# EAGLE design rpi-shield (EAGLE 9.6.2)
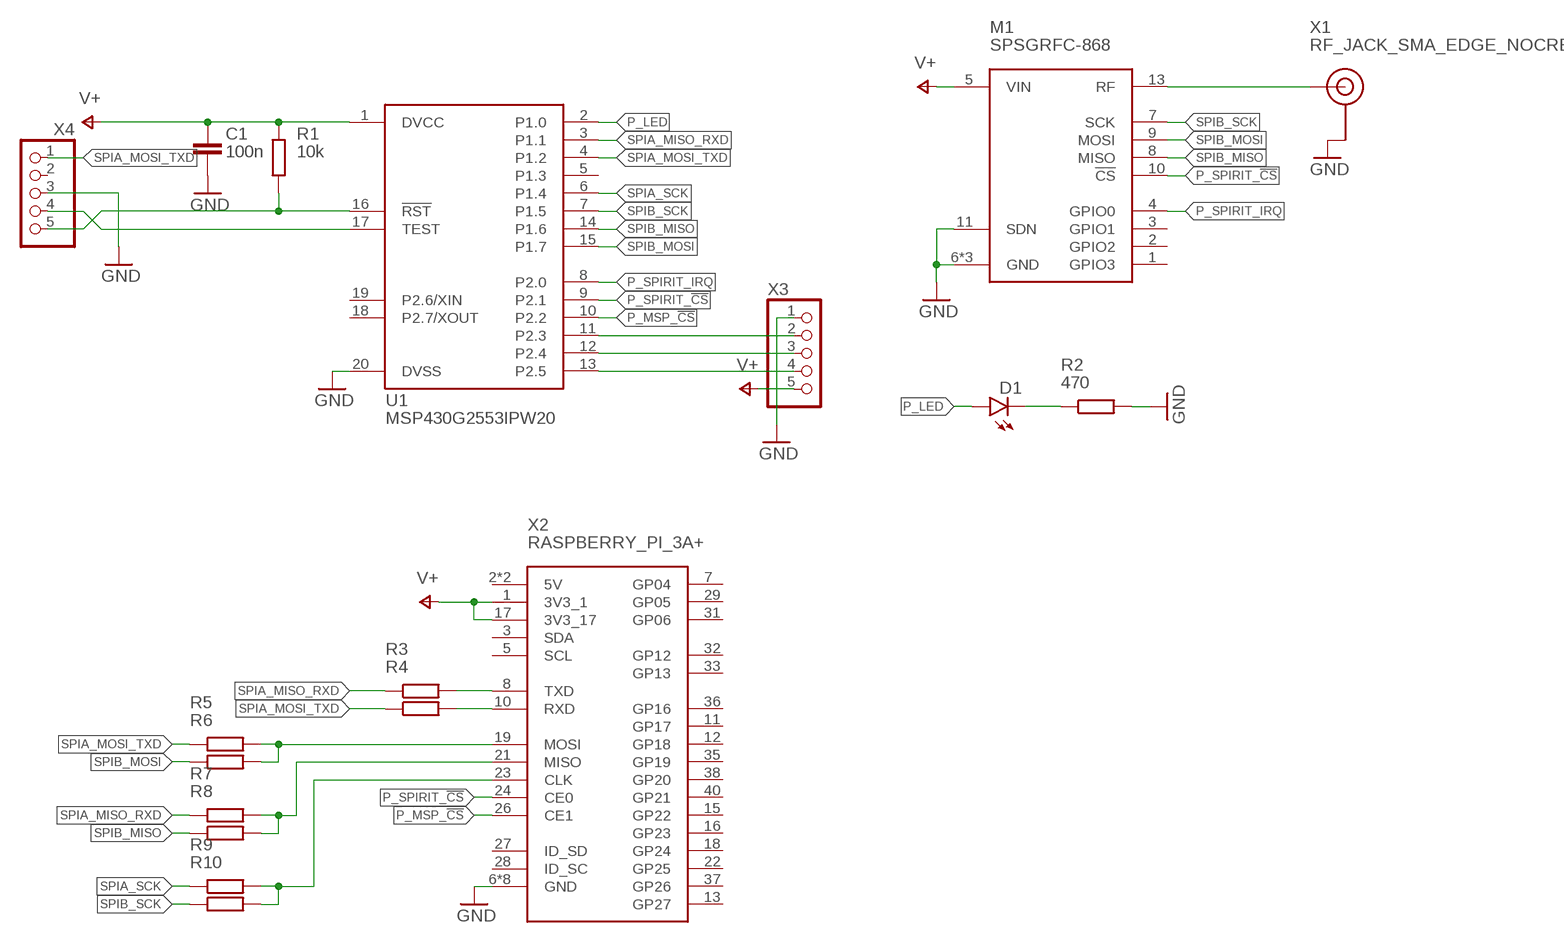
[diagram p0: schematic, sheet 1]

## Parts
C1  100n  C0603  [C0603]
D1  LEDCHIPLED_0805  [CHIPLED_0805]
M1  SPSGRFC-868  [SPSGRFC-868]
R1  10k  R0603  [R0603]
R2  470  R0603  [R0603]
R3  R0603_STOP  [R0603_STOP]
R4  R0603_STOP  [R0603_STOP]
R5  R0603_STOP  [R0603_STOP]
R6  R0603_STOP  [R0603_STOP]
R7  R0603_STOP  [R0603_STOP]
R8  R0603_STOP  [R0603_STOP]
R9  R0603_STOP  [R0603_STOP]
R10  R0603_STOP  [R0603_STOP]
U1  MSP430G2553IPW20  [PW20]
X1  RF_JACK_SMA_EDGE_NOCREAM  [RF_SMA_JACK_EDGE_NOCREAM]
X2  RASPBERRY_PI_3A+  [RASPBERRY_PI_3A+]
X3  PINHD_5_RND  [1X05]
X4  PINHD_5_RND  [1X05]

## Nets
GND: C1.2 M1.6(GND) M1.11(SDN) M1.12(GND) M1.14(GND) R2.2 U1.20(DVSS) X1.2(GND) X1.3(GND) X1.4(GND) X1.5(GND) X2.6(GND) X2.9(GND) X2.14(GND) X2.20(GND) X2.25(GND) X2.30(GND) X2.34(GND) X2.39(GND) X3.1 X4.3
N$1: D1.C R2.1
N$2: R1.1 U1.16(!RST!) X4.5
N$3: U1.17(TEST) X4.4
N$4: M1.13(RF) X1.1(SIGNAL)
N$5: R3.2 X2.8(TXD)
N$6: R4.2 X2.10(RXD)
N$7: R5.2 R6.2 X2.19(MOSI)
N$8: R7.2 R8.2 X2.21(MISO)
N$9: R9.2 R10.2 X2.23(CLK)
N$10: U1.13(P2.5) X3.4
N$11: U1.12(P2.4) X3.3
N$12: U1.11(P2.3) X3.2
P_LED: D1.A U1.2(P1.0)
P_MSP_!CS: U1.10(P2.2) X2.26(CE1)
P_SPIRIT_!CS: M1.10(!CS) U1.9(P2.1) X2.24(CE0)
P_SPIRIT_IRQ: M1.4(GPIO0) U1.8(P2.0)
SPIA_MISO_RXD: R3.1 R7.1 U1.3(P1.1)
SPIA_MOSI_TXD: R4.1 R5.1 U1.4(P1.2) X4.1
SPIA_SCK: R9.1 U1.6(P1.4)
SPIB_MISO: M1.8(MISO) R8.1 U1.14(P1.6)
SPIB_MOSI: M1.9(MOSI) R6.1 U1.15(P1.7)
SPIB_SCK: M1.7(SCK) R10.1 U1.7(P1.5)
V+: C1.1 M1.5(VIN) R1.2 U1.1(DVCC) X2.1(3V3_1) X2.17(3V3_17) X3.5
Unconnected: M1.1(GPIO3) M1.2(GPIO2) M1.3(GPIO1) U1.5(P1.3) U1.18(P2.7/XOUT) U1.19(P2.6/XIN) X2.2(5V) X2.3(SDA) X2.4(5V) X2.5(SCL) X2.7(GP04) X2.11(GP17) X2.12(GP18) X2.13(GP27) X2.15(GP22) X2.16(GP23) X2.18(GP24) X2.22(GP25) X2.27(ID_SD) X2.28(ID_SC) X2.29(GP05) X2.31(GP06) X2.32(GP12) X2.33(GP13) X2.35(GP19) X2.36(GP16) X2.37(GP26) X2.38(GP20) X2.40(GP21) X4.2

## Library data of the parts
C1 = rfr-lib-passive:C: Standard-SMD-Kondensatoren
D1 = led:LED: LED OSRAM: - CHIPLED LG R971, LG N971, LY N971, LG Q971, LY Q971, LO R971, LY R971 LH N974, LH R974 LS Q976, LO Q976, LY Q976 LO Q996 - Hyper CHIPLED LW Q18S LB Q993, LB Q99A, LB R99A - SideLED LS A670, LO A670, LY A670, LG A670, LP A670 LB A673, LV A673, LT A673, LW A673 LH A674 LY A675 LS A676, LA A676, LO A676, LY A676, LW A676 LS A679, LY A679, LG A679 - Hyper Micro SIDELED® LS Y876, LA Y876, LO Y876, LY Y876 LT Y87S - SmartLED LW L88C, LW L88S LB L89C, LB L89S, LG L890 LS L89K, LO L89K, LY L89K LS L896, LA L896, LO L896, LY L896 - TOPLED LS T670, LO T670, LY T670, LG T670, LP T670 LSG T670, LSP T670, LSY T670, LOP T670, LYG T670 LG T671, LOG T671, LSG T671 LB T673, LV T673, LT T673, LW T673 LH T674 LS T676, LA T676, LO T676, LY T676, LB T676, LH T676, LSB T676, LW T676 LB T67C, LV T67C, LT T67C, LS T67K, LO T67K, LY T67K, LW E67C LS E67B, LA E67B, LO E67B, LY E67B, LB E67C, LV E67C, LT E67C LW T67C LS T679, LY T679, LG T679 LS T770, LO T770, LY T770, LG T770, LP T770 LB T773, LV T773, LT T773, LW T773 LH T774 LS E675, LA E675, LY E675, LS T675 LS T776, LA T776, LO T776, LY T776, LB T776 LHGB T686 LT T68C, LB T68C - Hyper Mini TOPLED® LB M676 - Mini TOPLED Santana® LG M470 LS M47K, LO M47K, LY M47K Source: http://www.osram.convergy.de LUXEON: - LUMILED® LXK2-PW12-R00, LXK2-PW12-S00, LXK2-PW14-U00, LXK2-PW14-V00 LXK2-PM12-R00, LXK2-PM12-S00, LXK2-PM14-U00 LXK2-PE12-Q00, LXK2-PE12-R00, LXK2-PE12-S00, LXK2-PE14-T00, LXK2-PE14-U00 LXK2-PB12-K00, LXK2-PB12-L00, LXK2-PB12-M00, LXK2-PB14-N00, LXK2-PB14-P00, LXK2-PB14-Q00 LXK2-PR12-L00, LXK2-PR12-M00, LXK2-PR14-Q00, LXK2-PR14-R00 LXK2-PD12-Q00, LXK2-PD12-R00, LXK2-PD12-S00 LXK2-PH12-R00, LXK2-PH12-S00 LXK2-PL12-P00, LXK2-PL12-Q00, LXK2-PL12-R00 Source: www.luxeon.com KINGBRIGHT: KA-3528ASYC Source: www.kingbright.com
M1 = rfr-lib-radio:SPSGRFC-868
R1-R10 = rfr-lib-passive:R: Standard-SMD-Widerstände
U1 = rfr-lib-digital:MSP430G2553: MSP430G2XX1 TSSOP (PW) 20 Pin Package
X1 = rfr-lib-connector:RF_JACK: Standard SMA-Adapter mit vertikaler Befestigung
X2 = rfr-lib-misc:RASPBERRY_PI_3A+
X3 X4 = rfr-lib-connector:PINHD_5_RND

## Board
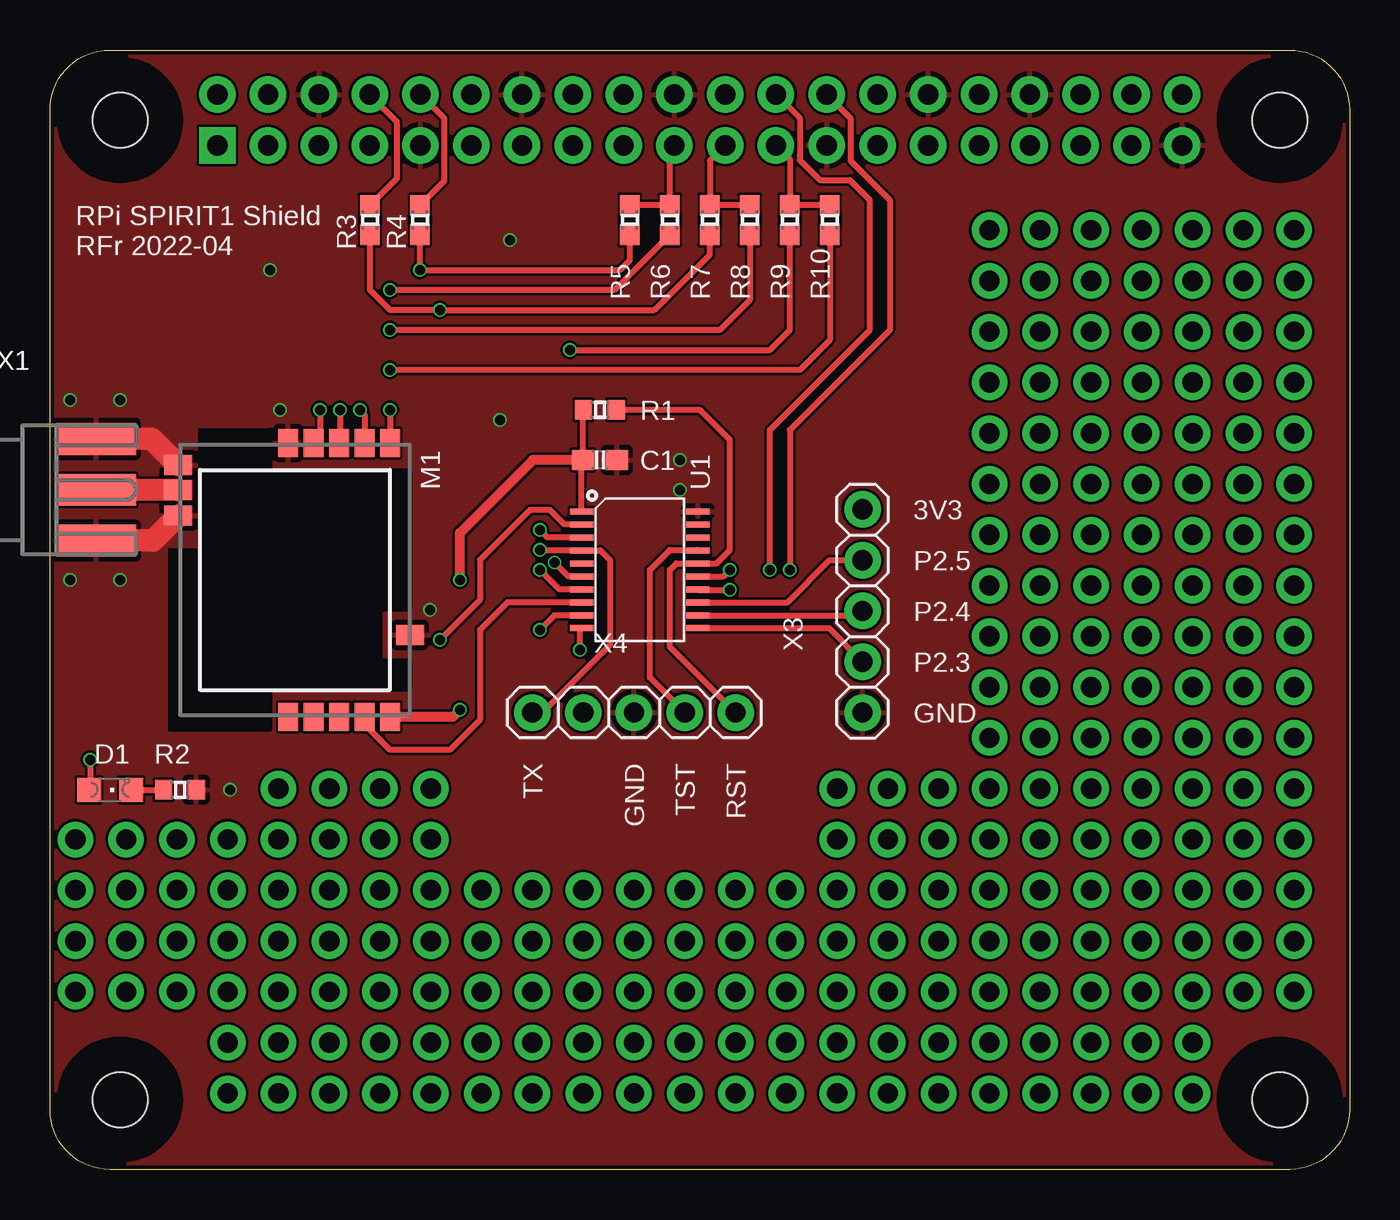
[diagram p1: board, top side]
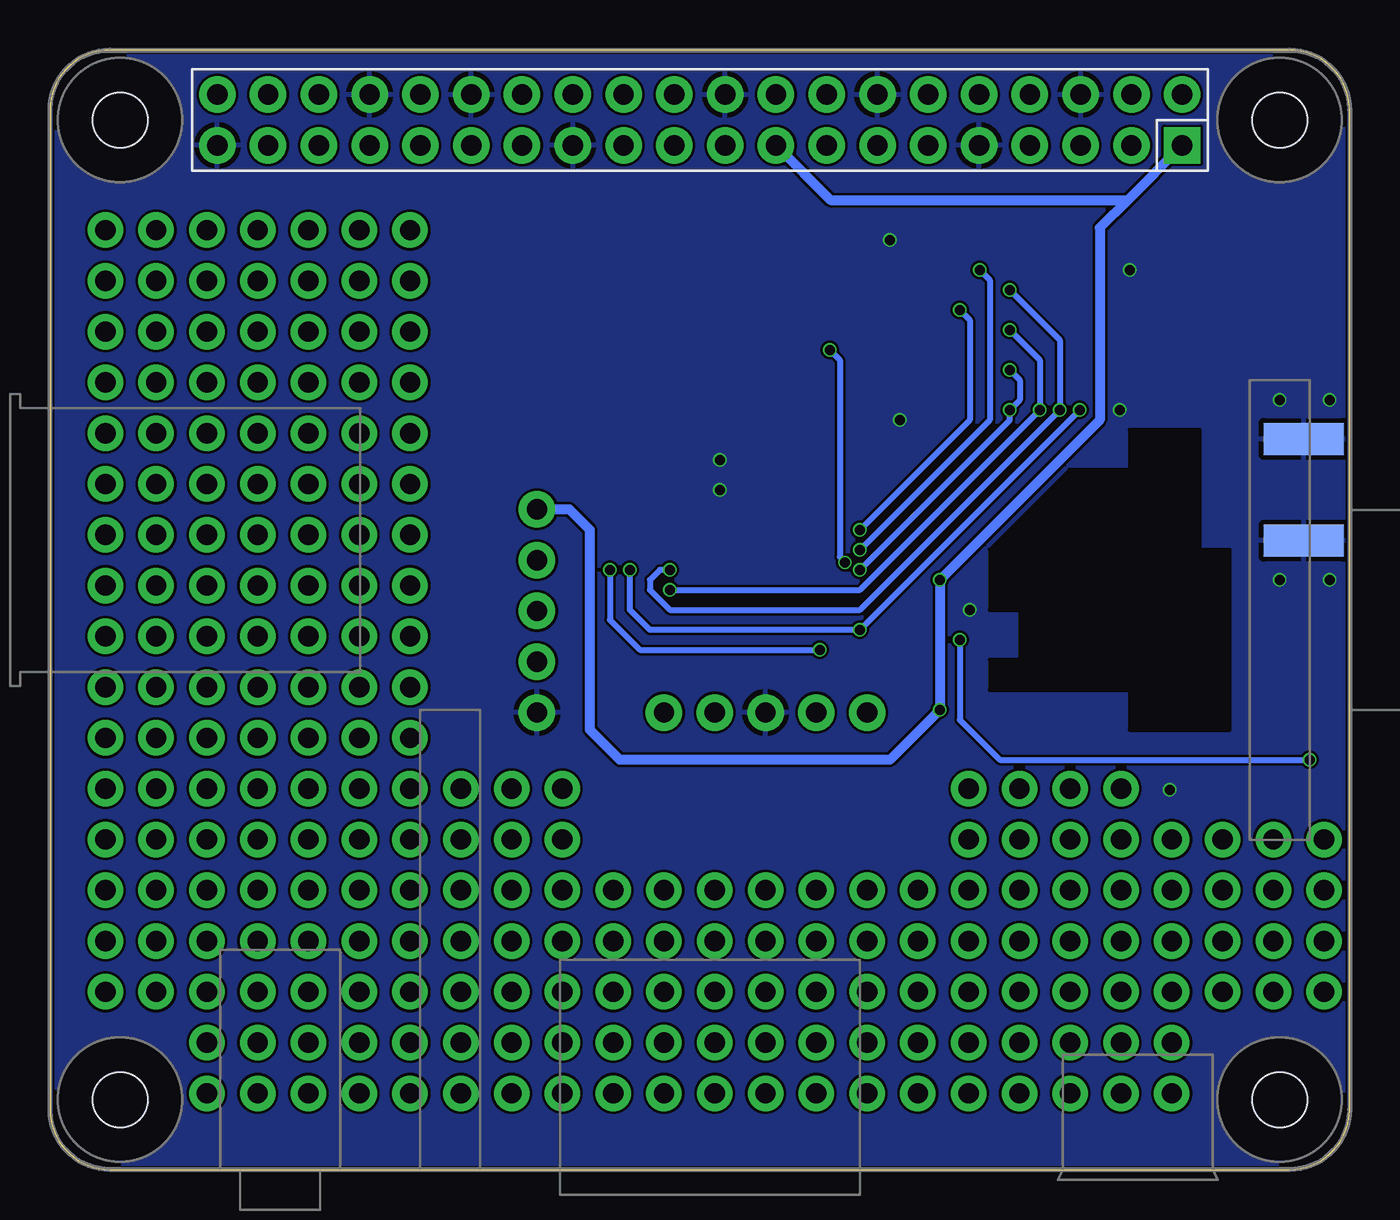
[diagram p2: board, bottom side, seen from below]

Size 65 x 56 mm. Coordinates in mm from the lower left corner, seen from the top.
Outline: 65,53 65,3 arc-90 62,0 3,0 arc-90 0,3 0,53 arc-90 3,56 62,56 arc-90 65,53
Copper layers (1*16): Top 0.035mm / dielectric 1.6mm / Bottom 0.035mm
Design rules "jlcpcb-2layers *": minimum track width 5mil, minimum drill 0.3mm, track to track 5mil, track to pad 5mil, pad to pad 5mil, via to via 5mil, smd to smd 5mil, copper to edge 0.2mm, drill to drill 6mil, minimum pad ring 10mil, minimum via ring 3mil, stop-mask expansion 4mil, vias tented up to drill 0.7mm, thermal gap 10mil
tRestrict: area 6,22 to 18,37
bRestrict: area 6,22 to 18,37

### Footprints (pad centres in the part's own frame; a part is rotated, then mirrored left to right if it is on the bottom)
C0603 = smd 1.1 x 1: 1 -0.85,0; 2 0.85,0
CHIPLED_0805 = smd 1.2 x 1.2: A 0,-1.05; C 0,1.05
SPSGRFC-868 = smd 1.4 x 1: 1 -6.85,6.08; 2 -6.85,4.81; 3 -6.85,3.54; 4 -6.85,2.27; 5 -6.85,1; 7 6.85,1; 8 6.85,2.27; 9 6.85,3.54; 10 6.85,4.81; 11 6.85,6.08 | smd 1 x 1.4: 6 -2.75,0; 12 5.75,11.6; 13 4.48,11.6; 14 3.21,11.6
R0603 = smd 0.87 x 0.98: 1 -0.815,0; 2 0.815,0
R0603_STOP = smd 1.05 x 0.98: 1 -0.725,0; 2 0.725,0
PW20 = smd 0.3 x 1.2: 1 -2.925,-2.9; 2 -2.275,-2.9; 3 -1.625,-2.9; 4 -0.975,-2.9; 5 -0.325,-2.9; 6 0.325,-2.9; 7 0.975,-2.9; 8 1.625,-2.9; 9 2.275,-2.9; 10 2.925,-2.9; 11 2.925,2.9; 12 2.275,2.9; 13 1.625,2.9; 14 0.975,2.9; 15 0.325,2.9; 16 -0.325,2.9; 17 -0.975,2.9; 18 -1.625,2.9; 19 -2.275,2.9; 20 -2.925,2.9
RF_SMA_JACK_EDGE_NOCREAM = smd 4 x 1.6: 1 2,0; 4 2,2.54; 5 2,-2.54 | smd 4 x 1.6 bottom: 2 2,2.54; 3 2,-2.54
RASPBERRY_PI_3A+ = drill 1.016 pad 1.778 square: 1 8.37,51.23 | drill 1.016 pad 1.778: 2 8.37,53.77; 3 10.91,51.23; 4 10.91,53.77; 5 13.45,51.23; 6 13.45,53.77; 7 15.99,51.23; 8 15.99,53.77; 9 18.53,51.23; 10 18.53,53.77; 11 21.07,51.23; 12 21.07,53.77; 13 23.61,51.23; 14 23.61,53.77; 15 26.15,51.23; 16 26.15,53.77; 17 28.69,51.23; 18 28.69,53.77; 19 31.23,51.23; 20 31.23,53.77; 21 33.77,51.23; 22 33.77,53.77; 23 36.31,51.23; 24 36.31,53.77; 25 38.85,51.23; 26 38.85,53.77; 27 41.39,51.23; 28 41.39,53.77; 29 43.93,51.23; 30 43.93,53.77; 31 46.47,51.23; 32 46.47,53.77; 33 49.01,51.23; 34 49.01,53.77; 35 51.55,51.23; 36 51.55,53.77; 37 54.09,51.23; 38 54.09,53.77; 39 56.63,51.23; 40 56.63,53.77 | hole 2.75: 3.5,3.5; 3.5,52.5; 61.5,3.5; 61.5,52.5
1X05 = drill 1.016 pad 1.778: 1 -5.08,0; 2 -2.54,0; 3 0,0; 4 2.54,0; 5 5.08,0

### Placement (x,y rotation side)
C1  27.5,35.5 0 top
D1  3,19 270 top
M1  18,29.5 90 top
R1  27.5,38 180 top
R2  6.5,19 0 top
R3  16,47.5 90 top
R4  18.5,47.5 90 top
R5  29,47.5 90 top
R6  31,47.5 90 top
R7  33,47.5 90 top
R8  35,47.5 90 top
R9  37,47.5 90 top
R10  39,47.5 90 top
U1  29.5,30 270 top
X1  0.3,34 0 top
X2  0,0 0 top
X3  40.64,27.94 90 top
X4  29.21,22.86 0 top

### Tracks (layer width: path | path; a pad name or v marks a point on that pad's centre or on a via)
GND  (via drill 0.5)
  Top 1.1: M1.12 5.11,36.54 X1.4 | M1.14 5.15,31.46 X1.5
  other vias: 1,38.5 3.5,38.5 1,29.5 3.5,29.5 11.5,38 19,28 9,19 31.5,34 31.5,35.5 23,46.5 22.5,37.5 11,45
  pour Top: -1,57 66,57 66,16.5 66,-1 38.5,-1 -1,-1
  pour Bottom: 65.5,56.5 -1.5,56.5 -1.5,16 -1.5,-1.5 26,-1.5 65.5,-1.5
N$1
  Top 0.3: D1.C R2.1
N$2
  Top 0.3: X4.5 31,26.15 31,30 31.32,30.32 U1.16 33.33,30.32 34,31 34,36.5 32.5,38 R1.1
N$3
  Top 0.3: X4.4 30,24.61 30,30 31,31 32.38,31 U1.17
N$4
  Top 1.1: M1.13 3.52,33.98 3.5,34 X1.1
N$5
  Top 0.3: X2.8 17.34,52.42 17.34,49.56 R3.2
N$6
  Top 0.3: X2.10 19.72,52.58 19.72,49.45 R4.2
N$7
  Top 0.3: R5.2 R6.2 31,51 X2.19
N$8
  Top 0.3: R8.2 R7.2 33,50.46 X2.21
N$9
  Top 0.3: X2.23 37,50.54 R9.2 R10.2
N$10
  Top 0.3: U1.13 36.88,28.38 38.98,30.48 X3.4
N$11
  Top 0.3: U1.12 40.42,27.73 X3.3
N$12
  Top 0.3: U1.11 38.97,27.07 X3.2
N$13  (via drill 1.02 pad 1.78)
  other vias: 1.27,16.51
N$14  (via drill 1.02 pad 1.78)
  other vias: 1.27,13.97
N$15  (via drill 1.02 pad 1.78)
  other vias: 1.27,11.43
N$16  (via drill 1.02 pad 1.78)
  other vias: 3.81,16.51
N$17  (via drill 1.02 pad 1.78)
  other vias: 3.81,13.97
N$18  (via drill 1.02 pad 1.78)
  other vias: 3.81,11.43
N$19  (via drill 1.02 pad 1.78)
  other vias: 6.35,16.51
N$20  (via drill 1.02 pad 1.78)
  other vias: 6.35,13.97
N$21  (via drill 1.02 pad 1.78)
  other vias: 6.35,11.43
N$22  (via drill 1.02 pad 1.78)
  other vias: 1.27,8.89
N$23  (via drill 1.02 pad 1.78)
  other vias: 3.81,8.89
N$24  (via drill 1.02 pad 1.78)
  other vias: 6.35,8.89
N$25  (via drill 1.02 pad 1.78)
  other vias: 8.89,16.51
N$26  (via drill 1.02 pad 1.78)
  other vias: 8.89,13.97
N$27  (via drill 1.02 pad 1.78)
  other vias: 8.89,11.43
N$28  (via drill 1.02 pad 1.78)
  other vias: 8.89,8.89
N$29  (via drill 1.02 pad 1.78)
  other vias: 8.89,6.35
N$30  (via drill 1.02 pad 1.78)
  other vias: 8.89,3.81
N$31  (via drill 1.02 pad 1.78)
  other vias: 11.43,3.81
N$32  (via drill 1.02 pad 1.78)
  other vias: 11.43,6.35
N$33  (via drill 1.02 pad 1.78)
  other vias: 11.43,8.89
N$34  (via drill 1.02 pad 1.78)
  other vias: 11.43,11.43
N$35  (via drill 1.02 pad 1.78)
  other vias: 11.43,13.97
N$36  (via drill 1.02 pad 1.78)
  other vias: 11.43,16.51
N$37  (via drill 1.02 pad 1.78)
  other vias: 11.43,19.05
N$38  (via drill 1.02 pad 1.78)
  other vias: 13.97,19.05
N$39  (via drill 1.02 pad 1.78)
  other vias: 13.97,16.51
N$40  (via drill 1.02 pad 1.78)
  other vias: 13.97,13.97
N$41  (via drill 1.02 pad 1.78)
  other vias: 13.97,11.43
N$42  (via drill 1.02 pad 1.78)
  other vias: 13.97,8.89
N$43  (via drill 1.02 pad 1.78)
  other vias: 13.97,6.35
N$44  (via drill 1.02 pad 1.78)
  other vias: 13.97,3.81
N$45  (via drill 1.02 pad 1.78)
  other vias: 16.51,3.81
N$46  (via drill 1.02 pad 1.78)
  other vias: 16.51,6.35
N$47  (via drill 1.02 pad 1.78)
  other vias: 16.51,8.89
N$48  (via drill 1.02 pad 1.78)
  other vias: 16.51,11.43
N$49  (via drill 1.02 pad 1.78)
  other vias: 16.51,13.97
N$50  (via drill 1.02 pad 1.78)
  other vias: 16.51,16.51
N$51  (via drill 1.02 pad 1.78)
  other vias: 16.51,19.05
N$52  (via drill 1.02 pad 1.78)
  other vias: 19.05,19.05
N$53  (via drill 1.02 pad 1.78)
  other vias: 19.05,16.51
N$54  (via drill 1.02 pad 1.78)
  other vias: 19.05,13.97
N$55  (via drill 1.02 pad 1.78)
  other vias: 19.05,11.43
N$56  (via drill 1.02 pad 1.78)
  other vias: 19.05,8.89
N$57  (via drill 1.02 pad 1.78)
  other vias: 19.05,6.35
N$58  (via drill 1.02 pad 1.78)
  other vias: 19.05,3.81
N$59  (via drill 1.02 pad 1.78)
  other vias: 59.69,16.51
N$60  (via drill 1.02 pad 1.78)
  other vias: 59.69,13.97
N$61  (via drill 1.02 pad 1.78)
  other vias: 59.69,11.43
N$62  (via drill 1.02 pad 1.78)
  other vias: 59.69,8.89
N$63  (via drill 1.02 pad 1.78)
  other vias: 59.69,19.05
N$64  (via drill 1.02 pad 1.78)
  other vias: 59.69,34.29
N$65  (via drill 1.02 pad 1.78)
  other vias: 59.69,31.75
N$66  (via drill 1.02 pad 1.78)
  other vias: 59.69,29.21
N$67  (via drill 1.02 pad 1.78)
  other vias: 59.69,26.67
N$68  (via drill 1.02 pad 1.78)
  other vias: 59.69,24.13
N$69  (via drill 1.02 pad 1.78)
  other vias: 59.69,21.59
N$70  (via drill 1.02 pad 1.78)
  other vias: 59.69,36.83
N$71  (via drill 1.02 pad 1.78)
  other vias: 59.69,39.37
N$72  (via drill 1.02 pad 1.78)
  other vias: 59.69,41.91
N$73  (via drill 1.02 pad 1.78)
  other vias: 59.69,44.45
N$74  (via drill 1.02 pad 1.78)
  other vias: 59.69,46.99
N$75  (via drill 1.02 pad 1.78)
  other vias: 62.23,16.51
N$76  (via drill 1.02 pad 1.78)
  other vias: 62.23,13.97
N$77  (via drill 1.02 pad 1.78)
  other vias: 62.23,11.43
N$78  (via drill 1.02 pad 1.78)
  other vias: 62.23,8.89
N$79  (via drill 1.02 pad 1.78)
  other vias: 62.23,19.05
N$80  (via drill 1.02 pad 1.78)
  other vias: 62.23,34.29
N$81  (via drill 1.02 pad 1.78)
  other vias: 62.23,31.75
N$82  (via drill 1.02 pad 1.78)
  other vias: 62.23,29.21
N$83  (via drill 1.02 pad 1.78)
  other vias: 62.23,26.67
N$84  (via drill 1.02 pad 1.78)
  other vias: 62.23,24.13
N$85  (via drill 1.02 pad 1.78)
  other vias: 62.23,21.59
N$86  (via drill 1.02 pad 1.78)
  other vias: 62.23,36.83
N$87  (via drill 1.02 pad 1.78)
  other vias: 62.23,39.37
N$88  (via drill 1.02 pad 1.78)
  other vias: 62.23,41.91
N$89  (via drill 1.02 pad 1.78)
  other vias: 62.23,44.45
N$90  (via drill 1.02 pad 1.78)
  other vias: 62.23,46.99
N$91  (via drill 1.02 pad 1.78)
  other vias: 21.59,3.81
N$92  (via drill 1.02 pad 1.78)
  other vias: 24.13,3.81
N$93  (via drill 1.02 pad 1.78)
  other vias: 26.67,3.81
N$94  (via drill 1.02 pad 1.78)
  other vias: 29.21,3.81
N$95  (via drill 1.02 pad 1.78)
  other vias: 31.75,3.81
N$96  (via drill 1.02 pad 1.78)
  other vias: 34.29,3.81
N$97  (via drill 1.02 pad 1.78)
  other vias: 36.83,3.81
N$98  (via drill 1.02 pad 1.78)
  other vias: 21.59,6.35
N$99  (via drill 1.02 pad 1.78)
  other vias: 24.13,6.35
N$100  (via drill 1.02 pad 1.78)
  other vias: 26.67,6.35
N$101  (via drill 1.02 pad 1.78)
  other vias: 39.37,16.51
N$102  (via drill 1.02 pad 1.78)
  other vias: 39.37,13.97
N$103  (via drill 1.02 pad 1.78)
  other vias: 39.37,11.43
N$104  (via drill 1.02 pad 1.78)
  other vias: 39.37,8.89
N$105  (via drill 1.02 pad 1.78)
  other vias: 39.37,6.35
N$106  (via drill 1.02 pad 1.78)
  other vias: 39.37,3.81
N$107  (via drill 1.02 pad 1.78)
  other vias: 39.37,19.05
N$108  (via drill 1.02 pad 1.78)
  other vias: 41.91,16.51
N$109  (via drill 1.02 pad 1.78)
  other vias: 41.91,13.97
N$110  (via drill 1.02 pad 1.78)
  other vias: 41.91,11.43
N$111  (via drill 1.02 pad 1.78)
  other vias: 41.91,8.89
N$112  (via drill 1.02 pad 1.78)
  other vias: 41.91,6.35
N$113  (via drill 1.02 pad 1.78)
  other vias: 41.91,3.81
N$114  (via drill 1.02 pad 1.78)
  other vias: 41.91,19.05
N$115  (via drill 1.02 pad 1.78)
  other vias: 44.45,16.51
N$116  (via drill 1.02 pad 1.78)
  other vias: 44.45,13.97
N$117  (via drill 1.02 pad 1.78)
  other vias: 44.45,11.43
N$118  (via drill 1.02 pad 1.78)
  other vias: 44.45,8.89
N$119  (via drill 1.02 pad 1.78)
  other vias: 44.45,6.35
N$120  (via drill 1.02 pad 1.78)
  other vias: 44.45,3.81
N$121  (via drill 1.02 pad 1.78)
  other vias: 44.45,19.05
N$122  (via drill 1.02 pad 1.78)
  other vias: 46.99,16.51
N$123  (via drill 1.02 pad 1.78)
  other vias: 46.99,13.97
N$124  (via drill 1.02 pad 1.78)
  other vias: 46.99,11.43
N$125  (via drill 1.02 pad 1.78)
  other vias: 46.99,8.89
N$126  (via drill 1.02 pad 1.78)
  other vias: 46.99,6.35
N$127  (via drill 1.02 pad 1.78)
  other vias: 46.99,3.81
N$128  (via drill 1.02 pad 1.78)
  other vias: 46.99,19.05
N$129  (via drill 1.02 pad 1.78)
  other vias: 46.99,34.29
N$130  (via drill 1.02 pad 1.78)
  other vias: 46.99,31.75
N$131  (via drill 1.02 pad 1.78)
  other vias: 46.99,29.21
N$132  (via drill 1.02 pad 1.78)
  other vias: 46.99,26.67
N$133  (via drill 1.02 pad 1.78)
  other vias: 46.99,24.13
N$134  (via drill 1.02 pad 1.78)
  other vias: 46.99,21.59
N$135  (via drill 1.02 pad 1.78)
  other vias: 46.99,36.83
N$136  (via drill 1.02 pad 1.78)
  other vias: 46.99,39.37
N$137  (via drill 1.02 pad 1.78)
  other vias: 46.99,41.91
N$138  (via drill 1.02 pad 1.78)
  other vias: 46.99,44.45
N$139  (via drill 1.02 pad 1.78)
  other vias: 46.99,46.99
N$140  (via drill 1.02 pad 1.78)
  other vias: 49.53,16.51
N$141  (via drill 1.02 pad 1.78)
  other vias: 49.53,13.97
N$142  (via drill 1.02 pad 1.78)
  other vias: 49.53,11.43
N$143  (via drill 1.02 pad 1.78)
  other vias: 49.53,8.89
N$144  (via drill 1.02 pad 1.78)
  other vias: 49.53,6.35
N$145  (via drill 1.02 pad 1.78)
  other vias: 49.53,3.81
N$146  (via drill 1.02 pad 1.78)
  other vias: 49.53,19.05
N$147  (via drill 1.02 pad 1.78)
  other vias: 49.53,34.29
N$148  (via drill 1.02 pad 1.78)
  other vias: 49.53,31.75
N$149  (via drill 1.02 pad 1.78)
  other vias: 49.53,29.21
N$150  (via drill 1.02 pad 1.78)
  other vias: 49.53,26.67
N$151  (via drill 1.02 pad 1.78)
  other vias: 49.53,24.13
N$152  (via drill 1.02 pad 1.78)
  other vias: 49.53,21.59
N$153  (via drill 1.02 pad 1.78)
  other vias: 49.53,36.83
N$154  (via drill 1.02 pad 1.78)
  other vias: 49.53,39.37
N$155  (via drill 1.02 pad 1.78)
  other vias: 49.53,41.91
N$156  (via drill 1.02 pad 1.78)
  other vias: 49.53,44.45
N$157  (via drill 1.02 pad 1.78)
  other vias: 49.53,46.99
N$158  (via drill 1.02 pad 1.78)
  other vias: 52.07,16.51
N$159  (via drill 1.02 pad 1.78)
  other vias: 52.07,13.97
N$160  (via drill 1.02 pad 1.78)
  other vias: 52.07,11.43
N$161  (via drill 1.02 pad 1.78)
  other vias: 52.07,8.89
N$162  (via drill 1.02 pad 1.78)
  other vias: 52.07,6.35
N$163  (via drill 1.02 pad 1.78)
  other vias: 52.07,3.81
N$164  (via drill 1.02 pad 1.78)
  other vias: 52.07,19.05
N$165  (via drill 1.02 pad 1.78)
  other vias: 52.07,34.29
N$166  (via drill 1.02 pad 1.78)
  other vias: 52.07,31.75
N$167  (via drill 1.02 pad 1.78)
  other vias: 52.07,29.21
N$168  (via drill 1.02 pad 1.78)
  other vias: 52.07,26.67
N$169  (via drill 1.02 pad 1.78)
  other vias: 52.07,24.13
N$170  (via drill 1.02 pad 1.78)
  other vias: 52.07,21.59
N$171  (via drill 1.02 pad 1.78)
  other vias: 52.07,36.83
N$172  (via drill 1.02 pad 1.78)
  other vias: 52.07,39.37
N$173  (via drill 1.02 pad 1.78)
  other vias: 52.07,41.91
N$174  (via drill 1.02 pad 1.78)
  other vias: 52.07,44.45
N$175  (via drill 1.02 pad 1.78)
  other vias: 52.07,46.99
N$176  (via drill 1.02 pad 1.78)
  other vias: 54.61,16.51
N$177  (via drill 1.02 pad 1.78)
  other vias: 54.61,13.97
N$178  (via drill 1.02 pad 1.78)
  other vias: 54.61,11.43
N$179  (via drill 1.02 pad 1.78)
  other vias: 54.61,8.89
N$180  (via drill 1.02 pad 1.78)
  other vias: 54.61,6.35
N$181  (via drill 1.02 pad 1.78)
  other vias: 54.61,3.81
N$182  (via drill 1.02 pad 1.78)
  other vias: 54.61,19.05
N$183  (via drill 1.02 pad 1.78)
  other vias: 54.61,34.29
N$184  (via drill 1.02 pad 1.78)
  other vias: 54.61,31.75
N$185  (via drill 1.02 pad 1.78)
  other vias: 54.61,29.21
N$186  (via drill 1.02 pad 1.78)
  other vias: 54.61,26.67
N$187  (via drill 1.02 pad 1.78)
  other vias: 54.61,24.13
N$188  (via drill 1.02 pad 1.78)
  other vias: 54.61,21.59
N$189  (via drill 1.02 pad 1.78)
  other vias: 54.61,36.83
N$190  (via drill 1.02 pad 1.78)
  other vias: 54.61,39.37
N$191  (via drill 1.02 pad 1.78)
  other vias: 54.61,41.91
N$192  (via drill 1.02 pad 1.78)
  other vias: 54.61,44.45
N$193  (via drill 1.02 pad 1.78)
  other vias: 54.61,46.99
N$194  (via drill 1.02 pad 1.78)
  other vias: 57.15,16.51
N$195  (via drill 1.02 pad 1.78)
  other vias: 57.15,13.97
N$196  (via drill 1.02 pad 1.78)
  other vias: 57.15,11.43
N$197  (via drill 1.02 pad 1.78)
  other vias: 57.15,8.89
N$198  (via drill 1.02 pad 1.78)
  other vias: 57.15,6.35
N$199  (via drill 1.02 pad 1.78)
  other vias: 57.15,3.81
N$200  (via drill 1.02 pad 1.78)
  other vias: 57.15,19.05
N$201  (via drill 1.02 pad 1.78)
  other vias: 57.15,34.29
N$202  (via drill 1.02 pad 1.78)
  other vias: 57.15,31.75
N$203  (via drill 1.02 pad 1.78)
  other vias: 57.15,29.21
N$204  (via drill 1.02 pad 1.78)
  other vias: 57.15,26.67
N$205  (via drill 1.02 pad 1.78)
  other vias: 57.15,24.13
N$206  (via drill 1.02 pad 1.78)
  other vias: 57.15,21.59
N$207  (via drill 1.02 pad 1.78)
  other vias: 57.15,36.83
N$208  (via drill 1.02 pad 1.78)
  other vias: 57.15,39.37
N$209  (via drill 1.02 pad 1.78)
  other vias: 57.15,41.91
N$210  (via drill 1.02 pad 1.78)
  other vias: 57.15,44.45
N$211  (via drill 1.02 pad 1.78)
  other vias: 57.15,46.99
N$212  (via drill 1.02 pad 1.78)
  other vias: 29.21,6.35
N$213  (via drill 1.02 pad 1.78)
  other vias: 31.75,6.35
N$214  (via drill 1.02 pad 1.78)
  other vias: 34.29,6.35
N$215  (via drill 1.02 pad 1.78)
  other vias: 36.83,6.35
N$216  (via drill 1.02 pad 1.78)
  other vias: 21.59,8.89
N$217  (via drill 1.02 pad 1.78)
  other vias: 24.13,8.89
N$218  (via drill 1.02 pad 1.78)
  other vias: 26.67,8.89
N$219  (via drill 1.02 pad 1.78)
  other vias: 29.21,8.89
N$220  (via drill 1.02 pad 1.78)
  other vias: 31.75,8.89
N$221  (via drill 1.02 pad 1.78)
  other vias: 34.29,8.89
N$222  (via drill 1.02 pad 1.78)
  other vias: 36.83,8.89
N$223  (via drill 1.02 pad 1.78)
  other vias: 21.59,11.43
N$224  (via drill 1.02 pad 1.78)
  other vias: 24.13,11.43
N$225  (via drill 1.02 pad 1.78)
  other vias: 26.67,11.43
N$226  (via drill 1.02 pad 1.78)
  other vias: 29.21,11.43
N$227  (via drill 1.02 pad 1.78)
  other vias: 31.75,11.43
N$228  (via drill 1.02 pad 1.78)
  other vias: 34.29,11.43
N$229  (via drill 1.02 pad 1.78)
  other vias: 36.83,11.43
N$230  (via drill 1.02 pad 1.78)
  other vias: 21.59,13.97
N$231  (via drill 1.02 pad 1.78)
  other vias: 24.13,13.97
N$232  (via drill 1.02 pad 1.78)
  other vias: 26.67,13.97
N$233  (via drill 1.02 pad 1.78)
  other vias: 29.21,13.97
N$234  (via drill 1.02 pad 1.78)
  other vias: 31.75,13.97
N$235  (via drill 1.02 pad 1.78)
  other vias: 34.29,13.97
N$236  (via drill 1.02 pad 1.78)
  other vias: 36.83,13.97
P_LED  (via drill 0.5)
  Top 0.3: U1.2 25.73,32.27 25,33 24,33 21.5,30.5 21.5,28.5 v19.5,26.5 | v2,20.5 2,19.05 D1.A
  Bottom 0.3: v19.5,26.5 19.5,22.5 17.5,20.5 v2,20.5
P_MSP_!CS  (via drill 0.5)
  Top 0.3: X2.26 40.04,52.58 40.04,50.46 42,48.5 42,42 37,37 v37,30 | v26.5,26 26.5,26.98 U1.10
  Bottom 0.3: v37,30 37,27.5 35.5,26 v26.5,26
P_SPIRIT_!CS  (via drill 0.5)
  Top 0.3: U1.9 25.23,27.73 v24.5,27 | v13.5,38 13.5,36.66 M1.10 | X2.24 37.5,52.58 37.5,50.74 37.5,50.73 37.5,50.5 38.5,49.5 40,49.5 41,48.5 41,42 36,37 v36,30
  Bottom 0.3: v13.5,38 v24.5,27 35,27 36,28 v36,30
P_SPIRIT_IRQ
  Top 0.3: U1.8 22.88,28.38 21.5,27 21.5,22.5 20,21 17,21 15.73,22.27 M1.4
SPIA_MISO_RXD  (via drill 0.5)
  Top 0.3: U1.3 24.88,31.62 v24.5,32 | R3.1 16,44 17,43 v19.5,43 30.23,43 33,45.77 R7.1
  Bottom 0.3: v24.5,32 19,37.5 19,42.5 v19.5,43
SPIA_MOSI_TXD  (via drill 0.5)
  Top 0.3: v24.5,31 24.52,30.98 U1.4 27.52,30.98 28,30.5 28,26.23 24.63,22.86 X4.1 | R4.1 v18.5,45 28.5,45 29,45.5 R5.1
  Bottom 0.3: v24.5,31 18,37.5 18,44.5 v18.5,45
SPIA_SCK  (via drill 0.5)
  Top 0.3: U1.6 25.93,29.68 v25.23,30.37 | v26,41 36,41 37,42 R9.1
  Bottom 0.3: v25.23,30.37 25.5,30.64 25.5,40.5 v26,41
SPIB_MISO  (via drill 0.5)
  Top 0.3: U1.14 32.42,29 v34,29 | v15.5,38 15.73,37.77 M1.8 | R8.1 35,43.5 33.5,42 v17,42
  Bottom 0.3: v34,29 24.5,29 v15.5,38 15.5,40.5 v17,42
SPIB_MOSI  (via drill 0.5)
  Top 0.3: U1.15 33.67,29.68 v34,30 | v14.5,38 14.5,36.39 M1.9 | R6.1 28.23,44 v17,44
  Bottom 0.3: v34,30 34.5,30 35,29.5 35,29 34,28 24.5,28 v14.5,38 14.5,41.5 v17,44
SPIB_SCK  (via drill 0.5)
  Top 0.3: U1.7 25.48,29.02 v24.5,30 | v17,38 M1.7 | R10.1 39,41.5 37.5,40 v17,40
  Bottom 0.3: v24.5,30 17,37.5 v17,38 16.5,38.5 16.5,39.5 v17,40
V+  (via drill 0.5)
  Top 0.3: U1.1 26.6,35.45 C1.1 26.65,37.97 R1.2
  Top 0.5: v20.5,23 20.15,22.65 M1.5 | C1.1 24.15,35.5 20.5,31.85 v20.5,29.5
  Bottom 0.5: X2.17 25.96,48.5 11.1,48.5 | X2.1 11.1,48.5 | 11.1,48.5 12.5,47.1 12.5,37.5 v20.5,29.5 v20.5,23 23,20.5 36.5,20.5 38,22 38,32 39.02,33.02 X3.5

### Text on the board
tPlace: RPi SPIRIT1 Shield / RFr 2022-04 | 3V3 | P2.5 | P2.4 | P2.3 | GND | TX | GND | TST | RST